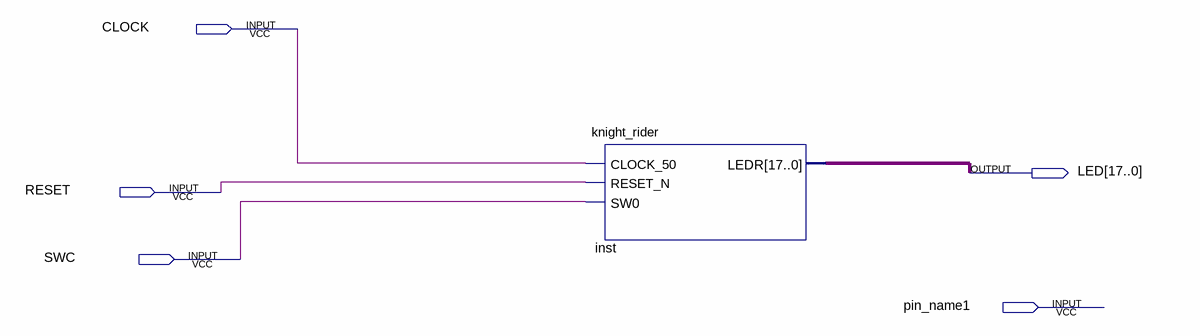
[diagram p0: schematic sheet]
// Quartus schematic TopLevel.bdf as structural Verilog: 1 symbols, 5 pins
module TopLevel (
  input  CLOCK,
  input  RESET,
  input  SWC,
  input  pin_name1,
  output [17:0] LED
);

  knight_rider inst (.CLOCK_50(CLOCK), .RESET_N(RESET), .SW0(SWC), .LEDR(LED));
endmodule
